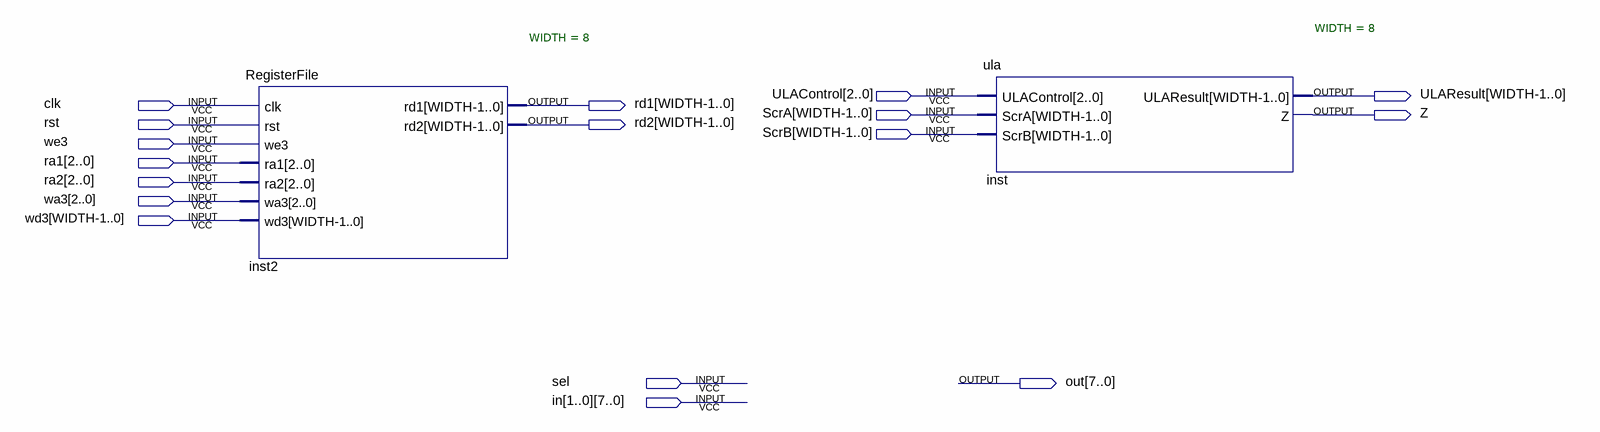
[diagram p0: schematic sheet]
// Quartus schematic mux.bdf as structural Verilog: 2 symbols, 17 pins
module mux (
  input  [2:0] ULAControl,
  input  clk,
  input  \ScrA[WIDTH-1..0] ,
  input  rst,
  input  \ScrB[WIDTH-1..0] ,
  input  we3,
  input  [2:0] ra1,
  input  [2:0] ra2,
  input  [2:0] wa3,
  input  \wd3[WIDTH-1..0] ,
  input  sel,
  input  [7:0] in_1,
  input  [7:0] in_0,
  output \ULAResult[WIDTH-1..0] ,
  output \rd1[WIDTH-1..0] ,
  output Z,
  output \rd2[WIDTH-1..0] ,
  output [7:0] out
);

  RegisterFile #(.WIDTH(8)) inst2 (
    .clk(clk), .rst(rst), .we3(we3), .ra1(ra1), .ra2(ra2), .wa3(wa3), .wd3({8{\wd3[WIDTH-1..0] }}),
    .rd1(\rd1[WIDTH-1..0] ), .rd2(\rd2[WIDTH-1..0] ));
  ula #(.WIDTH(8)) inst (
    .ULAControl(ULAControl), .ScrA({8{\ScrA[WIDTH-1..0] }}), .ScrB({8{\ScrB[WIDTH-1..0] }}),
    .ULAResult(\ULAResult[WIDTH-1..0] ), .Z(Z));
endmodule
